# Altium schematic sheet buck1.SchDoc
size A4
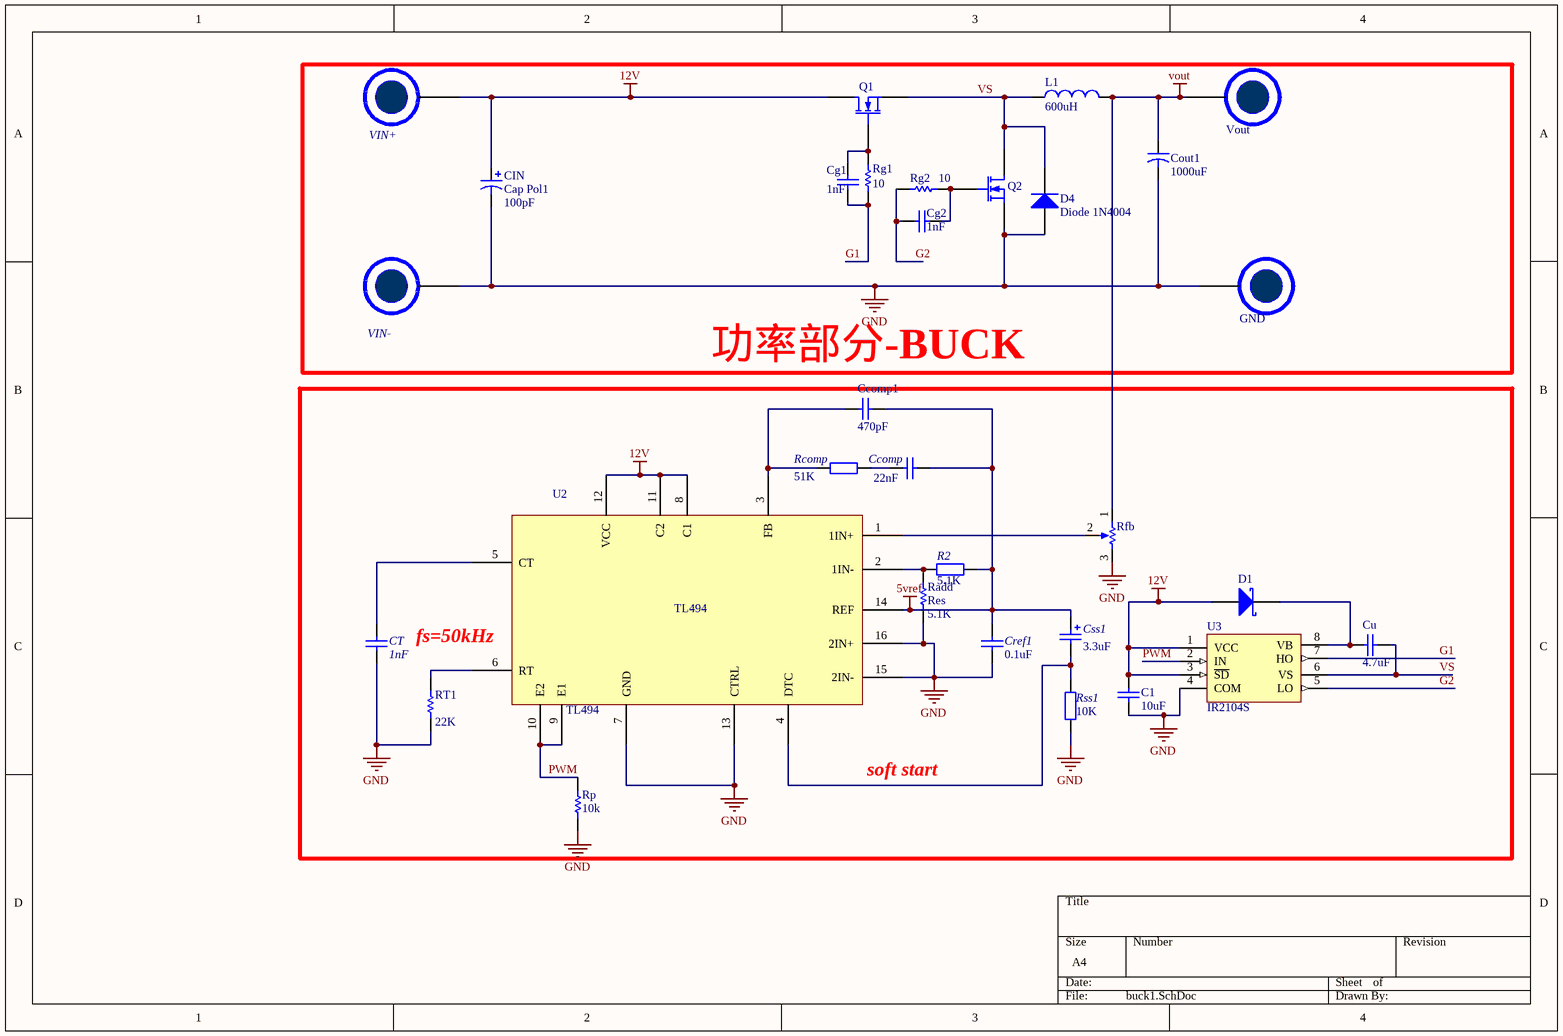
[diagram p0: buck1.SchDoc]

## Parts
C1  value 10uF  [1206(2)]  (hidden comment: Cap)
Ccomp  22nF  [C2012]
Ccomp1  value 470pF  [C2012]  (hidden comment: Cap)
Cg1  value 1nF  [1206(2)]  (hidden comment: Cap)
Cg2  value 1nF  [1206(2)]  (hidden comment: Cap)
CIN  Cap Pol1  value 100pF  [RB7.6-15]
Cout1  value 1000uF  [RB7.6-15]  (hidden comment: Cap2)
Cref1  0.1uF  [C2012]
Css1  3.3uF  [C2012]
CT  1nF  [C2012]
Cu  value 4.7uF  [1206(2)]  (hidden comment: Cap)
D1  D Schottky  [SK54]  (value not drawn)
D4  Diode 1N4004  [SK54]
GND  PIN  [PIN]  (value not drawn)
L1  value 600uH  [AXIAL-1.0]  (hidden comment: Inductor)
Q1  MOSFET-N  [nmos]  (value not drawn)
Q2  MOSFET-N  [nmos]  (value not drawn)
R2  5.1K  [R2012]
Radd  Res  value 5.1K  [R2012]
Rcomp  51K  [R2012]
Rfb  100k  [pot（长方形）]  (value not drawn)
Rg1  value 10  [1206(2)]  (hidden comment: Res1)
Rg2  value 10  [1206(2)]  (hidden comment: Res1)
Rp  value 10k  [1206(2)]  (hidden comment: Res1)
Rss1  10K  [R2012]
RT1  value 22K  [R2012]  (hidden comment: Res)
U2  TL494  [DIP-16]
U3  IR2104S  [ir2104]
VIN+  PIN  [PIN]  (value not drawn)
VIN-  PIN  [PIN]  (value not drawn)
Vout  PIN  [PIN]  (value not drawn)

## Blocks framed on the sheet
功率部分-BUCK: Cg1 Cg2 CIN Cout1 D4 GND L1 Q1 Q2 Rg1 Rg2 VIN+ VIN- Vout

## Nets
5vref: Ccomp.2 Ccomp1.1 Cref1.2 Css1.1 R2.2 U2.14(REF)
12V: C1.1 CIN.1 D1.1(A) Q1.2(D) U2.8(C1) U2.11(C2) U2.12(VCC) U3.1(VCC) U3.3(~{SD}) VIN+.1(PIN)
GND: C1.2 CIN.2 Cout1.2 Cref1.1 CT.1 D4.1(A) GND.1(PIN) Q2.3(S) Radd.1 Rfb.3(BOT) Rp.1 Rss1.1 RT1.1 U2.7(GND) U2.13(CTRL) U2.15(2IN-) U2.16(2IN+) U3.4(COM) VIN-.1(PIN)
vout: Cout1.1 L1.2 Rfb.1(TOP) Vout.1(PIN)
G1: Cg1.1 Rg1.1 U3.7(HO)
G2: Cg2.2 Rg2.2 U3.5(LO)
PWM: Rp.2 U2.9(E1) U2.10(E2) U3.2(IN)
VS: Cu.1 D4.2(K) L1.1 Q1.3(S) Q2.2(D) U3.6(VS)
NetCcomp1_2: Ccomp1.2 Rcomp.2 U2.3(FB)
NetCcomp_1: Ccomp.1 Rcomp.1
NetCg1_2: Cg1.2 Q1.1(G) Rg1.2
NetCg2_1: Cg2.1 Q2.1(G) Rg2.1
NetCss1_2: Css1.2 Rss1.2 U2.4(DTC)
NetCT_2: CT.2 U2.5(CT)
NetCu_2: Cu.2 D1.2(K) U3.8(VB)
NetR2_1: R2.1 Radd.2 U2.2(1IN-)
NetRfb_2: Rfb.2(TAP) U2.1(1IN+)
NetRT1_2: RT1.2 U2.6(RT)

## Notes on the sheet
- (near U2) fs=50kHz
- soft start

## Library data of the parts
C1 Ccomp1 Cg1 Cg2 Cu = Cap: Capacitor; Published: 8-Jun-2000; LatestRevisionDate: 17-Jul-2002; LatestRevisionNote: Re-released for DXP Platform.; PackageReference: RAD-0.3; Publisher: Altium Limited; PackageDescription: Radial Cap, Thru-Hole; 2 Leads; 0.3 in Pin Spacing
Ccomp Cref1 CT = ----Cap: 0.1uF 0805; Published: 8-Jun-2000; LatestRevisionDate: 17-Jul-2002; LatestRevisionNote: Re-released for DXP Platform.; PackageReference: RAD-0.3; Publisher: Altium Limited; Value: 0.1uF
CIN = Cap Pol1: Polarized Capacitor (Radial); Published: 8-Jun-2000; LatestRevisionDate: 17-Jul-2002; LatestRevisionNote: Re-released for DXP Platform.; PackageReference: RB7.6-15; Publisher: Altium Limited; PackageDescription: Polarized Capacitor (Radial); 2 Leads
Cout1 = Cap2: Capacitor; Published: 23-Sep-2002; PackageReference: CAPR5-4X5; Publisher: Altium Limited
Css1 = ----Cap Pol1: 10uF RAD0.1_; Published: 8-Jun-2000; LatestRevisionDate: 17-Jul-2002; LatestRevisionNote: Re-released for DXP Platform.; PackageReference: RB7.6-15; Publisher: Altium Limited
D1 = D Schottky: Schottky Diode; Published: 8-Jun-2000; LatestRevisionDate: 17-Jul-2002; LatestRevisionNote: Re-released for DXP Platform.; PackageReference: SMB; Publisher: Altium Limited; Code_JEDEC: DO-214-AA
D4 = Diode 1N4004: 1 Amp General Purpose Rectifier; Published: 8-Jun-2000; LatestRevisionDate: 17-Jul-2002; LatestRevisionNote: Re-released for DXP Platform.; DatasheetVersion: 1998; PackageVersion: Aug-1999; PackageReference: DO-41; Publisher: Altium Limited; PackageDescription: Diode, Axial; Body 5.2 x 2.7 mm (LxDia. max), Lead Dia. 0.86 mm (max); Code_JEDEC: DO-204-AL; ComponentLink1Description: Manufacturer Link; ComponentLink1URL: http://www.fairchildsemi.com/; ComponentLink2Description: Datasheet; ComponentLink2URL: http://www.fairchildsemi.com/ds/1N%2F1N4001.pdf
L1 = Inductor: Code_IEC: 1005; Published: 8-Jun-2000; LatestRevisionDate: 17-Jul-2002; LatestRevisionNote: Re-released for DXP Platform.; PackageReference: 0402-A; Publisher: Altium Limited; Code_JEITA: 0402
Q1 Q2 = MOSFET-N: N-Channel MOSFET; PackageDocument: 1995/1996; Published: 8-Jun-2000; LatestRevisionDate: 17-Jul-2002; LatestRevisionNote: Re-released for DXP Platform.; PackageReference: E3; Publisher: Altium Limited
R2 Rcomp Rss1 = ---Res1: 0805_; Published: 8-Jun-2000; LatestRevisionDate: 17-Jul-2002; LatestRevisionNote: Re-released for DXP Platform.; PackageReference: AXIAL-0.4; Publisher: Altium Limited
Radd RT1 = Res: 贴片电阻; Published: 8-Jun-2000; LatestRevisionDate: 17-Jul-2002; LatestRevisionNote: Re-released for DXP Platform.; PackageReference: AXIAL-0.3; Publisher: Altium Limited
Rfb = RPot: Potentiometer; Sim Note: Enter the Resistance value and the set point into parameter fields.; Set Position: 0.5; Value: 104; Published: 8-Jun-2000; LatestRevisionDate: 17-Jul-2002; LatestRevisionNote: Re-released for DXP Platform.; PackageReference: VR5; Publisher: Altium Limited
Rg1 Rg2 Rp = Res1: Resistor; Published: 8-Jun-2000; LatestRevisionDate: 17-Jul-2002; LatestRevisionNote: Re-released for DXP Platform.; PackageReference: AXIAL-0.3; Publisher: Altium Limited
U3 = IR2104S: High and Low Side Driver; Published: 8-Jun-2000; LatestRevisionDate: 13-Apr-2006; LatestRevisionNote: IPC-7351 Footprint Added.; DatasheetVersion: PD600461; PackageVersion: Feb-2001; PackageReference: SO-8; Publisher: Altium Limited; PackageDescription: 8-Pin Plastic Small Outline Integrated Circuit 1.27 mm Pitch; Code_JEDEC: MS-012-AA; Code_IPC: SOIC127P600-8; ComponentLink1Description: Manufacturer Link; ComponentLink1URL: http://www.irf.com/; ComponentLink2Description: Datasheet; ComponentLink2URL: http://www.irf.com/product-info/datasheets/data/ir2104.pdf